# EAGLE design MicroMod_Sno_Processor (EAGLE 9.5.2)
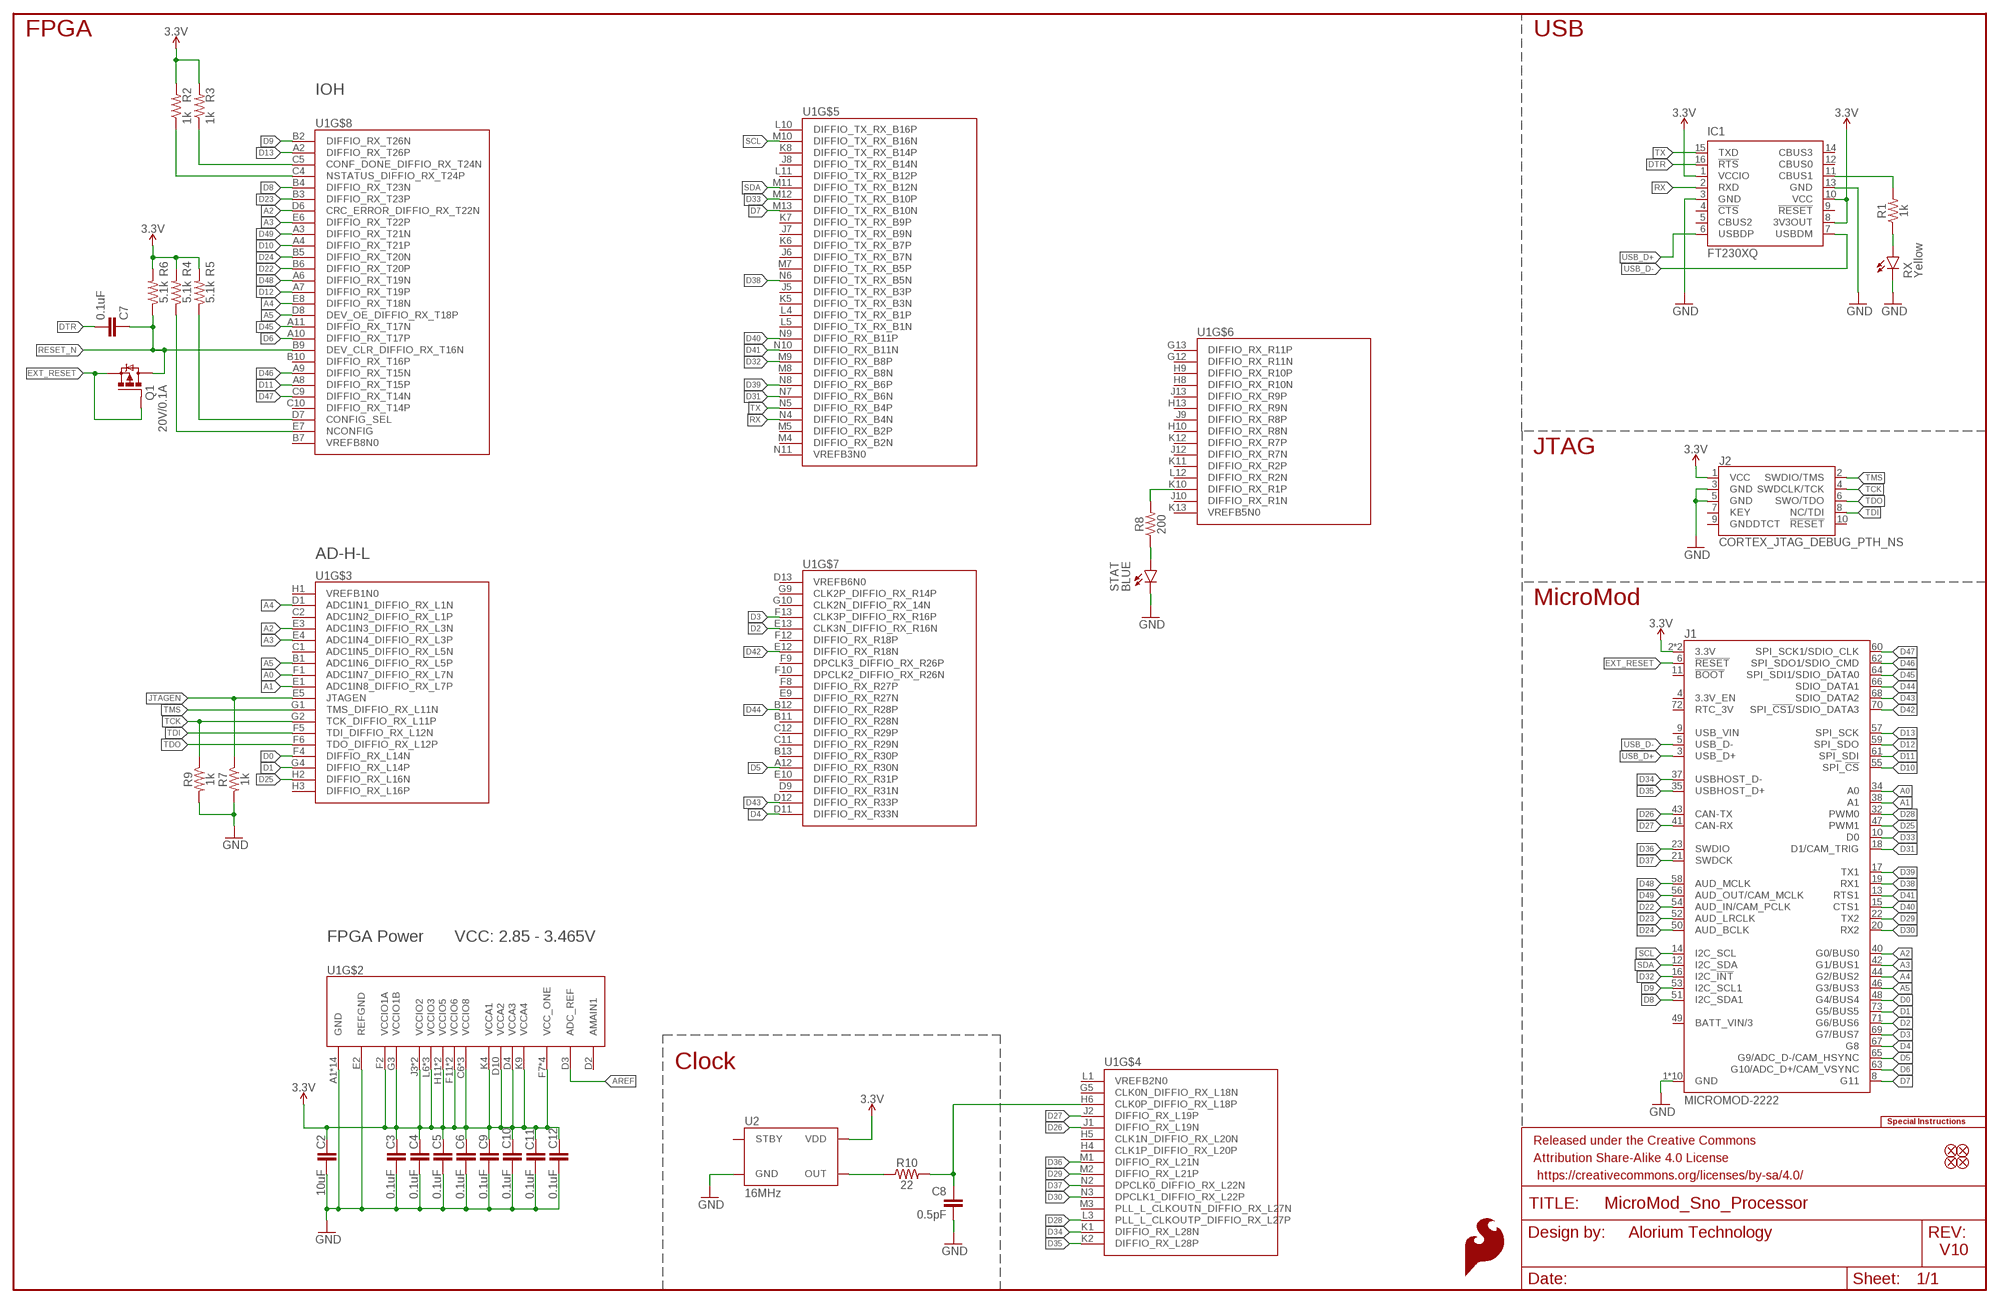
[diagram p0: schematic, sheet 1]

## Parts
C2  10uF  10UF-0402T-6.3V-20%  [0402-TIGHT]
C3  0.1uF  0.1UF-0402T-6.3V-10%-X7R  [0402-TIGHT]
C4  0.1uF  0.1UF-0402T-6.3V-10%-X7R  [0402-TIGHT]
C5  0.1uF  0.1UF-0402T-6.3V-10%-X7R  [0402-TIGHT]
C6  0.1uF  0.1UF-0402T-6.3V-10%-X7R  [0402-TIGHT]
C7  0.1uF  0.1UF-0402T-6.3V-10%-X7R  [0402-TIGHT]
C8  0.5pF  0.5PF-0402_TIGHT-50V-PM0.05PF-NP0  [0402-TIGHT]
C9  0.1uF  0.1UF-0402T-6.3V-10%-X7R  [0402-TIGHT]
C10  0.1uF  0.1UF-0402T-6.3V-10%-X7R  [0402-TIGHT]
C11  0.1uF  0.1UF-0402T-6.3V-10%-X7R  [0402-TIGHT]
C12  0.1uF  0.1UF-0402T-6.3V-10%-X7R  [0402-TIGHT]
FID1  FIDUCIAL1X2  [FIDUCIAL-1X2]
FID2  FIDUCIAL1X2  [FIDUCIAL-1X2]
FID3  FIDUCIAL1X2  [FIDUCIAL-1X2]
FID4  FIDUCIAL1X2  [FIDUCIAL-1X2]
FRAME1  FRAME-LEDGER  [CREATIVE_COMMONS]
IC1  FT230XQ  [QFN16]
J1  MICROMOD-2222  [M.2-CARD-E-22]
J2  CORTEX_JTAG_DEBUG_PTH_NS  [2X5-PTH-1.27MM-NO_SILK]
LOGO1  SPECIAL_INSTRUCTIONS-ORDERING  [ORDERING_INSTRUCTIONS]
LOGO2  SFE_LOGO_FLAME.1_INCH  [SFE_LOGO_FLAME_.1]
Q1  20V/0.1A  RE1C001ZP  [SOT-416]
R1  1k  1KOHM-0402T-1/16W-1%  [0402-TIGHT]
R2  1k  1KOHM-0402T-1/16W-1%  [0402-TIGHT]
R3  1k  1KOHM-0402T-1/16W-1%  [0402-TIGHT]
R4  5.1k  5.1KOHM-0402T-1/16W-1%  [0402-TIGHT]
R5  5.1k  5.1KOHM-0402T-1/16W-1%  [0402-TIGHT]
R6  5.1k  5.1KOHM-0402T-1/16W-1%  [0402-TIGHT]
R7  1k  1KOHM-0402T-1/16W-1%  [0402-TIGHT]
R8  200  200OHM-0402T-1/16W-1%  [0402-TIGHT]
R9  1k  1KOHM-0402T-1/16W-1%  [0402-TIGHT]
R10  22  22OHM-0402T-1/16W-1%  [0402-TIGHT]
RX  Yellow  LED-YELLOW0603  [LED-0603]
STAT  BLUE  LED-BLUE0603  [LED-0603]
U1  10M08SA  [UBGA_169]
U2  16MHz  OSC_TINY_16SMD20X16  [SMD20X16]

## Nets
3.3V: C2.1 C3.1 C4.1 C5.1 C6.1 C9.1 C10.1 C11.1 C12.1 IC1.1(VCCIO) IC1.8(3V3OUT) IC1.10(VCC) J1.2(3.3V) J1.74(3.3V) J2.1(VCC) R2.2 R3.2 R4.2 R5.2 R6.2 U1.C6(VCCIO8) U1.C7(VCCIO8) U1.C8(VCCIO8) U1.D4(VCCA3) U1.D10(VCCA2) U1.F2(VCCIO1A) U1.F7(VCC_ONE) U1.F11(VCCIO6) U1.G3(VCCIO1B) U1.G6(VCC_ONE) U1.G8(VCC_ONE) U1.G11(VCCIO6) U1.H7(VCC_ONE) U1.H11(VCCIO5) U1.J3(VCCIO2) U1.J11(VCCIO5) U1.K3(VCCIO2) U1.K4(VCCA1) U1.K9(VCCA4) U1.L6(VCCIO3) U1.L7(VCCIO3) U1.L8(VCCIO3) U2.4(VDD)
A0: J1.34(A0) U1.F1(ADC1IN7_DIFFIO_RX_L7N)
A1: J1.38(A1) U1.E1(ADC1IN8_DIFFIO_RX_L7P)
A2: J1.40(G0/BUS0) U1.D6(CRC_ERROR_DIFFIO_RX_T22N) U1.E3(ADC1IN3_DIFFIO_RX_L3N)
A3: J1.42(G1/BUS1) U1.E4(ADC1IN4_DIFFIO_RX_L3P) U1.E6(DIFFIO_RX_T22P)
A4: J1.44(G2/BUS2) U1.D1(ADC1IN1_DIFFIO_RX_L1N) U1.E8(DIFFIO_RX_T18N)
A5: J1.46(G3/BUS3) U1.B1(ADC1IN6_DIFFIO_RX_L5P) U1.D8(DEV_OE_DIFFIO_RX_T18P)
AREF: U1.D3(ADC_REF)
CLK: C8.1 R10.2 U1.H6(CLK0P_DIFFIO_RX_L18P)
D0: J1.48(G4/BUS4) U1.F4(DIFFIO_RX_L14N)
D1: J1.73(G5/BUS5) U1.G4(DIFFIO_RX_L14P)
D2: J1.71(G6/BUS6) U1.E13(CLK3N_DIFFIO_RX_R16N)
D3: J1.69(G7/BUS7) U1.F13(CLK3P_DIFFIO_RX_R16P)
D4: J1.67(G8) U1.D11(DIFFIO_RX_R33N)
D5: J1.65(G9/ADC_D-/CAM_HSYNC) U1.A12(DIFFIO_RX_R30N)
D6: J1.63(G10/ADC_D+/CAM_VSYNC) U1.A10(DIFFIO_RX_T17P)
D7: J1.8(G11) U1.M13(DIFFIO_TX_RX_B10N)
D8: J1.51(I2C_SDA1) U1.B4(DIFFIO_RX_T23N)
D9: J1.53(I2C_SCL1) U1.B2(DIFFIO_RX_T26N)
D10: J1.55(SPI_!CS!) U1.A4(DIFFIO_RX_T21P)
D11: J1.61(SPI_SDI) U1.A8(DIFFIO_RX_T15P)
D12: J1.59(SPI_SDO) U1.A7(DIFFIO_RX_T19P)
D13: J1.57(SPI_SCK) U1.A2(DIFFIO_RX_T26P)
D22: J1.54(AUD_IN/CAM_PCLK) U1.B6(DIFFIO_RX_T20P)
D23: J1.52(AUD_LRCLK) U1.B3(DIFFIO_RX_T23P)
D24: J1.50(AUD_BCLK) U1.B5(DIFFIO_RX_T20N)
D25: J1.47(PWM1) U1.H2(DIFFIO_RX_L16N)
D26: J1.43(CAN-TX) U1.J1(DIFFIO_RX_L19N)
D27: J1.41(CAN-RX) U1.J2(DIFFIO_RX_L19P)
D28: J1.32(PWM0) U1.L3(PLL_L_CLKOUTP_DIFFIO_RX_L27P)
D29: J1.22(TX2) U1.M2(DIFFIO_RX_L21P)
D30: J1.20(RX2) U1.N3(DPCLK1_DIFFIO_RX_L22P)
D31: J1.18(D1/CAM_TRIG) U1.N7(DIFFIO_RX_B6N)
D32: J1.16(I2C_!INT!) U1.M9(DIFFIO_RX_B8P)
D33: J1.10(D0) U1.M12(DIFFIO_TX_RX_B10P)
D34: J1.37(USBHOST_D-) U1.K1(DIFFIO_RX_L28N)
D35: J1.35(USBHOST_D+) U1.K2(DIFFIO_RX_L28P)
D36: J1.23(SWDIO) U1.M1(DIFFIO_RX_L21N)
D37: J1.21(SWDCK) U1.N2(DPCLK0_DIFFIO_RX_L22N)
D38: J1.19(RX1) U1.N6(DIFFIO_TX_RX_B5N)
D39: J1.17(TX1) U1.N8(DIFFIO_RX_B6P)
D40: J1.15(CTS1) U1.N9(DIFFIO_RX_B11P)
D41: J1.13(RTS1) U1.N10(DIFFIO_RX_B11N)
D42: J1.70(SPI_!CS1!/SDIO_DATA3) U1.E12(DIFFIO_RX_R18N)
D43: J1.68(SDIO_DATA2) U1.D12(DIFFIO_RX_R33P)
D44: J1.66(SDIO_DATA1) U1.B12(DIFFIO_RX_R28P)
D45: J1.64(SPI_SDI1/SDIO_DATA0) U1.A11(DIFFIO_RX_T17N)
D46: J1.62(SPI_SDO1/SDIO_CMD) U1.A9(DIFFIO_RX_T15N)
D47: J1.60(SPI_SCK1/SDIO_CLK) U1.C9(DIFFIO_RX_T14N)
D48: J1.58(AUD_MCLK) U1.A6(DIFFIO_RX_T19N)
D49: J1.56(AUD_OUT/CAM_MCLK) U1.A3(DIFFIO_RX_T21N)
DTR: C7.2 IC1.16(!RTS)
EXT_RESET: J1.6(!RESET!) Q1.P1(G) Q1.P2(S)
GND: C2.2 C3.2 C4.2 C5.2 C6.2 C8.2 C9.2 C10.2 C11.2 C12.2 IC1.3(GND) IC1.13(GND) J1.1(GND) J1.7(GND) J1.33(GND) J1.36(GND) J1.39(GND) J1.45(GND) J1.75(GND) J1.GND1(GND) J1.GND2(GND) J1.GND3(GND) J2.3(GND) J2.5(GND) R7.2 R9.2 RX.C STAT.C U1.A1(GND) U1.A13(GND) U1.B8(GND) U1.C3(GND) U1.D5(GND) U1.E2(REFGND) U1.E11(GND) U1.F3(GND) U1.G7(GND) U1.H12(GND) U1.J4(GND) U1.L9(GND) U1.M6(GND) U1.N1(GND) U1.N13(GND) U2.2(GND)
JTAGEN: R7.1 U1.E5(JTAGEN)
N$2: R1.1 RX.A
N$18: R3.1 U1.C5(CONF_DONE_DIFFIO_RX_T24N)
N$36: R8.1 STAT.A
N$59: R2.1 U1.C4(NSTATUS_DIFFIO_RX_T24P)
N$67: R5.1 U1.D7(CONFIG_SEL)
NCONFIG: R4.1 U1.E7(NCONFIG)
OSC: R10.1 U2.3(OUT)
RESET_N: C7.1 Q1.P3(D) R6.1 U1.B9(DEV_CLR_DIFFIO_RX_T16N)
RX: IC1.2(RXD) U1.N4(DIFFIO_RX_B4N)
RXLED: IC1.11(CBUS1) R1.2
SCL: J1.14(I2C_SCL) U1.M10(DIFFIO_TX_RX_B16N)
SDA: J1.12(I2C_SDA) U1.M11(DIFFIO_TX_RX_B12N)
STAT: R8.2 U1.K10(DIFFIO_RX_R1P)
TCK: J2.4(SWDCLK/TCK) R9.1 U1.G2(TCK_DIFFIO_RX_L11P)
TDI: J2.8(NC/TDI) U1.F5(TDI_DIFFIO_RX_L12N)
TDO: J2.6(SWO/TDO) U1.F6(TDO_DIFFIO_RX_L12P)
TMS: J2.2(SWDIO/TMS) U1.G1(TMS_DIFFIO_RX_L11N)
TX: IC1.15(TXD) U1.N5(DIFFIO_RX_B4P)
USB_D+: IC1.6(USBDP) J1.3(USB_D+)
USB_D-: IC1.7(USBDM) J1.5(USB_D-)
Unconnected: IC1.4(!CTS) IC1.5(CBUS2) IC1.9(!RESET) IC1.12(CBUS0) IC1.14(CBUS3) J1.4(3.3V_EN) J1.9(USB_VIN) J1.11(!BOOT!) J1.49(BATT_VIN/3) J1.72(RTC_3V) J2.7(KEY) J2.9(GNDDTCT) J2.10(!RESET) U1.B7(VREFB8N0) U1.B10(DIFFIO_RX_T16P) U1.B11(DIFFIO_RX_R28N) U1.B13(DIFFIO_RX_R30P) U1.C1(ADC1IN5_DIFFIO_RX_L5N) U1.C2(ADC1IN2_DIFFIO_RX_L1P) U1.C10(DIFFIO_RX_T14P) U1.C11(DIFFIO_RX_R29N) U1.C12(DIFFIO_RX_R29P) U1.D2(AMAIN1) U1.D9(DIFFIO_RX_R31N) U1.D13(VREFB6N0) U1.E9(DIFFIO_RX_R27N) U1.E10(DIFFIO_RX_R31P) U1.F8(DIFFIO_RX_R27P) U1.F9(DPCLK3_DIFFIO_RX_R26P) U1.F10(DPCLK2_DIFFIO_RX_R26N) U1.F12(DIFFIO_RX_R18P) U1.G5(CLK0N_DIFFIO_RX_L18N) U1.G9(CLK2P_DIFFIO_RX_R14P) U1.G10(CLK2N_DIFFIO_RX_14N) U1.G12(DIFFIO_RX_R11N) U1.G13(DIFFIO_RX_R11P) U1.H1(VREFB1N0) U1.H3(DIFFIO_RX_L16P) U1.H4(CLK1P_DIFFIO_RX_L20P) U1.H5(CLK1N_DIFFIO_RX_L20N) U1.H8(DIFFIO_RX_R10N) U1.H9(DIFFIO_RX_R10P) U1.H10(DIFFIO_RX_R8N) U1.H13(DIFFIO_RX_R9N) U1.J5(DIFFIO_TX_RX_B3P) U1.J6(DIFFIO_TX_RX_B7N) U1.J7(DIFFIO_TX_RX_B9N) U1.J8(DIFFIO_TX_RX_B14N) U1.J9(DIFFIO_RX_R8P) U1.J10(DIFFIO_RX_R1N) U1.J12(DIFFIO_RX_R7N) U1.J13(DIFFIO_RX_R9P) U1.K5(DIFFIO_TX_RX_B3N) U1.K6(DIFFIO_TX_RX_B7P) U1.K7(DIFFIO_TX_RX_B9P) U1.K8(DIFFIO_TX_RX_B14P) U1.K11(DIFFIO_RX_R2P) U1.K12(DIFFIO_RX_R7P) U1.K13(VREFB5N0) U1.L1(VREFB2N0) U1.L4(DIFFIO_TX_RX_B1P) U1.L5(DIFFIO_TX_RX_B1N) U1.L10(DIFFIO_TX_RX_B16P) U1.L11(DIFFIO_TX_RX_B12P) U1.L12(DIFFIO_RX_R2N) U1.M3(PLL_L_CLKOUTN_DIFFIO_RX_L27N) U1.M4(DIFFIO_RX_B2N) U1.M5(DIFFIO_RX_B2P) U1.M7(DIFFIO_TX_RX_B5P) U1.M8(DIFFIO_RX_B8N) U1.N11(VREFB3N0) U2.1(STBY)

## Notes on the sheet
- FPGA | USB
- IOH
- JTAG
- AD-H-L
- MicroMod
- FPGA Power | VCC: 2.85 - 3.465V
- Clock
- Alorium Technology
- V10

## Library data of the parts
C2 = SparkFun-Capacitors:10UF: 10.0µF ceramic capacitors A capacitor is a passive two-terminal electrical component used to store electrical energy temporarily in an electric field.; PROD_ID: CAP-14848
C3-C7 C9-C12 = SparkFun-Capacitors:0.1UF: 0.1µF ceramic capacitors A capacitor is a passive two-terminal electrical component used to store electrical energy temporarily in an electric field.; PROD_ID: CAP-14993
C8 = SparkFun-Capacitors:0.5PF: 0.5pF ceramic capacitors A capacitor is a passive two-terminal electrical component used to store electrical energy temporarily in an electric field.; PROD_ID: CAP-14362
FID1-FID4 = SparkFun-Aesthetics:FIDUCIAL: Fiducial Alignment Points Point-of-reference for pick-and-place machines and other optical instruments.
FRAME1 = SparkFun-Aesthetics:FRAME-LEDGER: Schematic Frame - Ledger Standard 11x14 US Ledger frame
IC1 = New_Parts:FT230X: USB to BASIC UART IC Auto generated by make-symbol-device-package-bsdl.ulp Rev. 43 Source: Data sheet <http://www.ftdichip.com/Support/Documents/DataSheets/ICs/DS_FT230X.pdf>; DIGIKEY_PART: 768-1130-2-ND; PROD_ID: IC-15930
J1 = SparkFun-MicroMod:MICROMOD: MicroMod Connector Description: A card edge connector and mating PCB connector to allow various MicroMod Processor Boards to be coupled with various carrier boards of different capabilities. Based on the M.2 standard.
J2 = SparkFun-Connectors:CORTEX_JTAG_DEBUG: Cortex Debug Connector - 10 pin Supports JTAG debug, Serial Wire debug, and Serial Wire Viewer. PTH and SMD connector options available. General Connector Information <http://infocenter.arm.com/help/topic/com.arm.doc.faqs/attached/13634/cortex_debug_connectors.pdf> Products: PTH Connector <http://www.digikey.com/product-detail/en/cnc-tech/3220-10-0100-00/1175-1627-ND/3883661> -via Digi-Key SparkFun PSoc <https://www.sparkfun.com/products/13229> SparkFun T <https://www.sparkfun.com/products/13810>
LOGO1 = SparkFun-Aesthetics:SPECIAL_INSTRUCTIONS: Special Ordering/Production Instructions Alert Symbol for special PCB ordering instructions or unique production process warnings. Ordering Instructions Production Instructions Types of information that should be added to box: Copper weight Soldermask color Silk color PCB thickness Number of layers PCB Standard: 1.6mm FR4 1 oz copper immersion silver plating red soldermask white silkscreen Types of information that should be added to box: Special wash requirements Depaneling instructions Humidification Glue curing Default text settings: 0.07 inch 9% ratio 50% line distance
LOGO2 = SparkFun-Aesthetics:SFE_LOGO_FLAME: SparkFun Flame Logo This is the SparkFun flame logo. The logo on the schematic will always be the same size; the package variant is the height of the flame. Default layer for the logo on the board is tSilk.
Q1 = New_Parts:RE1C001ZP; PROD_ID: TRANS-15421
R1-R3 R7 R9 = SparkFun-Resistors:1KOHM: 1kΩ resistor A resistor is a passive two-terminal electrical component that implements electrical resistance as a circuit element. Resistors act to reduce current flow, and, at the same time, act to lower voltage levels within circuits. - Wikipedia; PROD_ID: RES-14342
R4-R6 = SparkFun-Resistors:5.1KOHM; PROD_ID: RES-14340
R8 = SparkFun-Resistors:200OHM: 200Ω resistor A resistor is a passive two-terminal electrical component that implements electrical resistance as a circuit element. Resistors act to reduce current flow, and, at the same time, act to lower voltage levels within circuits. - Wikipedia; PROD_ID: RES-15550
R10 = SparkFun-Resistors:22OHM: 22Ω resistor A resistor is a passive two-terminal electrical component that implements electrical resistance as a circuit element. Resistors act to reduce current flow, and, at the same time, act to lower voltage levels within circuits. - Wikipedia; PROD_ID: RES-12427; VALUE: 22Ω
RX = SparkFun-LED:LED-YELLOW: Yellow SMD LED Used in manufacturing several products at SparkFun. Packages: 0603 - SMD 0603 package[Product Link] <http://www.kingbrightusa.com/product.asp?catalog_name=LED&product_id=APT1608SYCK> 0603 -SMART - SMART SMD 0603 package (more efficient/more expensive) [Product Link] <http://www.osram-os.com/osram_os/en/products/product-catalog/led-light-emitting-diodes/smartled-0603/ly-l29k/index.jsp> LilyPad - SMD1206 package[Product Datasheet] <https://www.sparkfun.com/datasheets/DevTools/LilyPad/Q150YUS4.pdf> SparkFun Products: Blynk Board <https://www.sparkfun.com/products/13794> IOIO-OTG <https://www.sparkfun.com/products/13613> XBee Explorer Serial <https://www.sparkfun.com/products/13225>; PROD_ID: DIO-09003
STAT = SparkFun-LED:LED-BLUE: Blue SMD LED Used in manufacturing of various products at SparkFun Packages: 0603 - SMD 0603 package [Product Link] <http://www.digikey.com/product-detail/en/SMLE12BC7TT86/511-1589-2-ND/1641808> 1206 - SMD1206 package [Product Link] <http://www.digikey.com/product-detail/en/lite-on-inc/LTST-C150TBKT/160-1643-1-ND/573584> SparkFun Products: ESP8266 Thing-Dev Board <https://www.sparkfun.com/products/13711> RedBoard <https://www.sparkfun.com/products/12757>; PROD_ID: DIO-08575
U1 = New_Parts:10M08SA; DIGIKEY_PART: 544-3110-ND; PROD_ID: IC-15931
U2 = New_Parts:OSC_TINY_16; PROD_ID: XTAL-16018

## Board
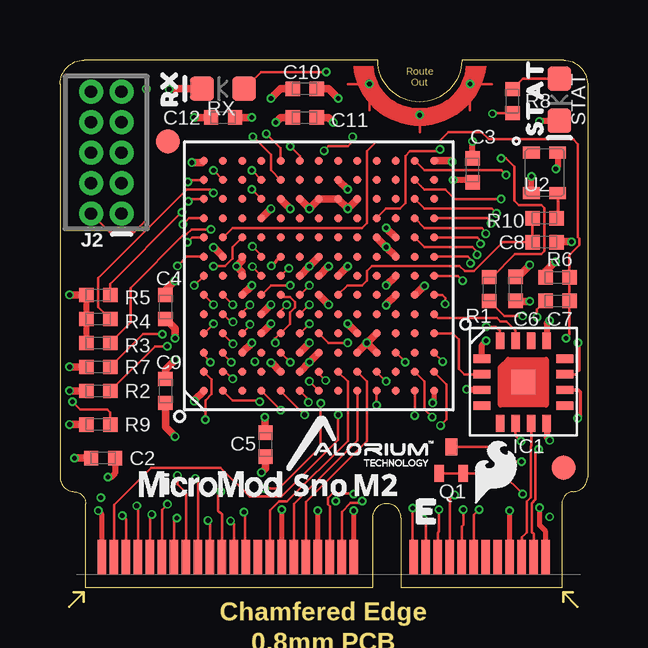
[diagram p1: board, top side]
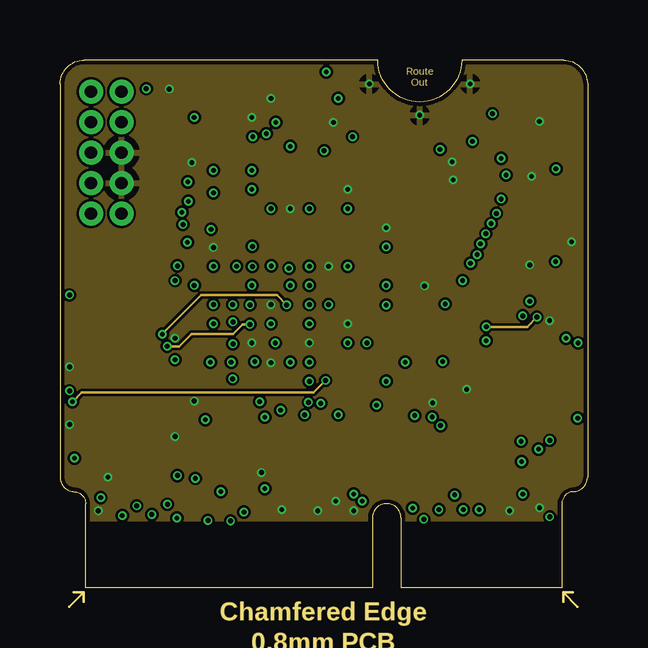
[diagram p2: board, inner layer Route2]
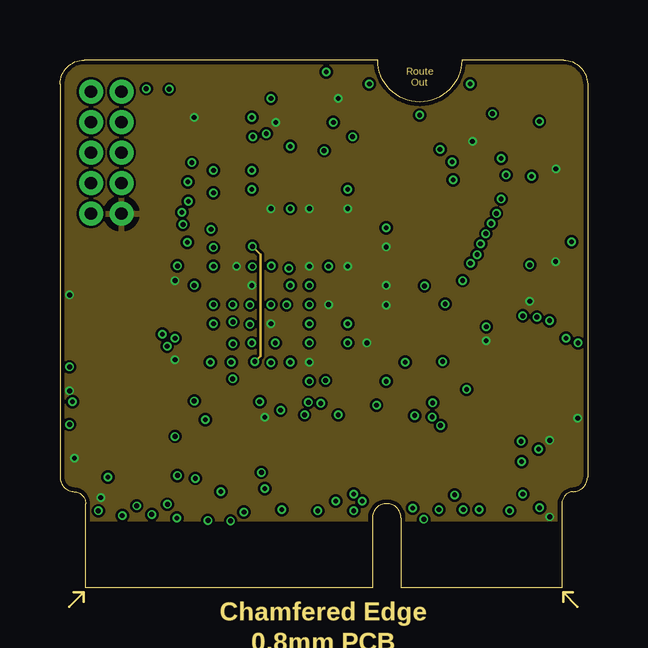
[diagram p3: board, inner layer Route15]
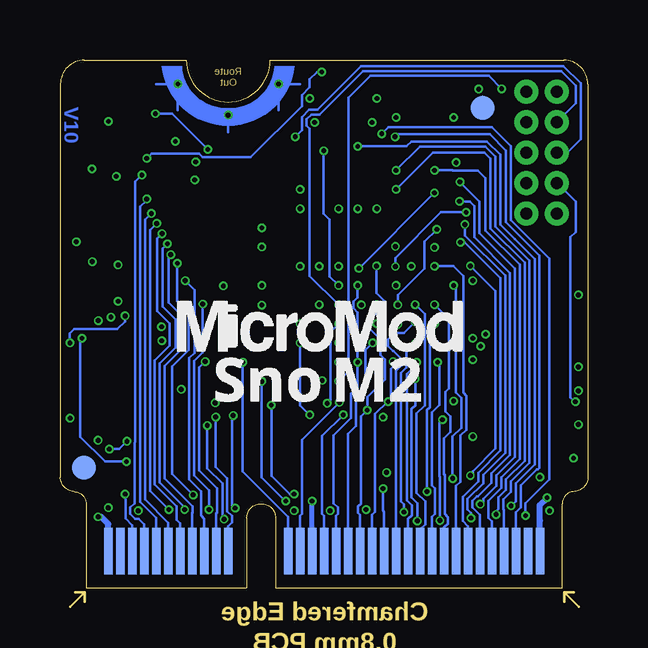
[diagram p4: board, bottom side, seen from below]

Size 22 x 22 mm. Coordinates in mm from the lower left corner, seen from the top.
Outline: 16.75,22 21,22 arc-87 22,21 22,4.6 arc-87 21.4,4 arc85 20.93,3.5 20.93,0 14.22,0 14.22,2.9 arc180 13.03,2.9 13.03,0 1.07,0 1.07,3.5 arc84 0.6,4 arc-87 0,4.6 0,21 arc-87 1,22 13.25,22
Outline: 16.75,22 arc-180 13.25,22
Outline: 16.75,22 arc-180 13.25,22
Copper layers (1+2*15+16): Top 0.035mm / dielectric 1.5mm / Route2 0.035mm / dielectric 0.15mm / Route15 0.035mm / dielectric 0.2mm / Bottom 0.035mm
Design rules "SparkFun-4-Layer-MicroMod-JLCPCB": minimum track width 4mil, minimum drill 0.2mm, track to track 4mil, track to pad 4mil, pad to pad 4mil, via to via 4mil, smd to smd 4mil, copper to edge 6mil, drill to drill 6mil, minimum pad ring 3mil, minimum via ring 3mil, stop-mask expansion 2.5mil, vias tented up to drill 25mil, thermal gap 10mil

### Footprints (pad centres in the part's own frame; a part is rotated, then mirrored left to right if it is on the bottom)
0402-TIGHT = smd 0.6 x 0.6: 1 -0.5,0; 2 0.5,0
FIDUCIAL-1X2 = smd 1 x 1: 1 0,0
QFN16 = smd 0.7 x 0.35: 1 -1.725,0.975; 2 -1.725,0.325; 3 -1.725,-0.325; 4 -1.725,-0.975; 9 1.725,-0.975; 10 1.725,-0.325; 11 1.725,0.325; 12 1.725,0.975 | smd 0.35 x 0.7: 5 -0.975,-1.725; 6 -0.325,-1.725; 7 0.325,-1.725; 8 0.975,-1.725; 13 0.975,1.725; 14 0.325,1.725; 15 -0.325,1.725; 16 -0.975,1.725 | smd 1 x 1: TAB 0,0
M.2-CARD-E-22 = smd 0.35 x 1.45: 1 9.25,1.275; 3 8.75,1.275; 5 8.25,1.275; 7 7.75,1.275; 9 7.25,1.275; 11 6.75,1.275; 13 6.25,1.275; 15 5.75,1.275; 17 5.25,1.275; 19 4.75,1.275; 21 4.25,1.275; 23 3.75,1.275; 33 1.25,1.275; 35 0.75,1.275; 37 0.25,1.275; 39 -0.25,1.275; 41 -0.75,1.275; 43 -1.25,1.275; 45 -1.75,1.275; 47 -2.25,1.275; 49 -2.75,1.275; 51 -3.25,1.275; 53 -3.75,1.275; 55 -4.25,1.275; 57 -4.75,1.275; 59 -5.25,1.275; 61 -5.75,1.275; 63 -6.25,1.275; 65 -6.75,1.275; 67 -7.25,1.275; 69 -7.75,1.275; 71 -8.25,1.275; 73 -8.75,1.275; 75 -9.25,1.275 | smd 0.35 x 1.95 bottom: 2 9,1.525; 4 8.5,1.525; 6 8,1.525; 8 7.5,1.525; 10 7,1.525; 12 6.5,1.525; 14 6,1.525; 16 5.5,1.525; 18 5,1.525; 20 4.5,1.525; 22 4,1.525; 32 1.5,1.525; 34 1,1.525; 36 0.5,1.525; 38 0,1.525; 40 -0.5,1.525; 42 -1,1.525; 44 -1.5,1.525; 46 -2,1.525; 48 -2.5,1.525; 50 -3,1.525; 52 -3.5,1.525; 54 -4,1.525; 56 -4.5,1.525; 58 -5,1.525; 60 -5.5,1.525; 62 -6,1.525; 64 -6.5,1.525; 66 -7,1.525; 68 -7.5,1.525; 70 -8,1.525; 72 -8.5,1.525; 74 -9,1.525 | drill 0.2: GND1 1.9,21; GND2 4,19.7; GND3 6.1,21
2X5-PTH-1.27MM-NO_SILK = drill 0.508 pad 1: 1 -2.54,-0.635; 2 -2.54,0.635; 3 -1.27,-0.635; 4 -1.27,0.635; 5 0,-0.635; 6 0,0.635; 7 1.27,-0.635; 8 1.27,0.635; 9 2.54,-0.635; 10 2.54,0.635
SOT-416 = smd 0.4 x 0.7: P1 -0.5,0; P2 0.5,0 | smd 0.5 x 0.7: P3 0,1.1
LED-0603 = smd 1 x 1: A -0.877,0; C 0.877,0
UBGA_169 = smd 0.34 x 0.34: A1 -9.6,0; A2 -8.8,0; A3 -8,0; A4 -7.2,0; A5 -6.4,0; A6 -5.6,0; A7 -4.8,0; A8 -4,0; A9 -3.2,0; A10 -2.4,0; A11 -1.6,0; A12 -0.8,0; A13 0,0; B1 -9.6,-0.8; B2 -8.8,-0.8; B3 -8,-0.8; B4 -7.2,-0.8; B5 -6.4,-0.8; B6 -5.6,-0.8; B7 -4.8,-0.8; B8 -4,-0.8; B9 -3.2,-0.8; B10 -2.4,-0.8; B11 -1.6,-0.8; B12 -0.8,-0.8; B13 0,-0.8; C1 -9.6,-1.6; C2 -8.8,-1.6; C3 -8,-1.6; C4 -7.2,-1.6; C5 -6.4,-1.6; C6 -5.6,-1.6; C7 -4.8,-1.6; C8 -4,-1.6; C9 -3.2,-1.6; C10 -2.4,-1.6; C11 -1.6,-1.6; C12 -0.8,-1.6; C13 0,-1.6; D1 -9.6,-2.4; D2 -8.8,-2.4; D3 -8,-2.4; D4 -7.2,-2.4; D5 -6.4,-2.4; D6 -5.6,-2.4; D7 -4.8,-2.4; D8 -4,-2.4; D9 -3.2,-2.4; D10 -2.4,-2.4; D11 -1.6,-2.4; D12 -0.8,-2.4; D13 0,-2.4; E1 -9.6,-3.2; E2 -8.8,-3.2; E3 -8,-3.2; E4 -7.2,-3.2; E5 -6.4,-3.2; E6 -5.6,-3.2; E7 -4.8,-3.2; E8 -4,-3.2; E9 -3.2,-3.2; E10 -2.4,-3.2; E11 -1.6,-3.2; E12 -0.8,-3.2; E13 0,-3.2; F1 -9.6,-4; F2 -8.8,-4; F3 -8,-4; F4 -7.2,-4; F5 -6.4,-4; F6 -5.6,-4; F7 -4.8,-4; F8 -4,-4; F9 -3.2,-4; F10 -2.4,-4; F11 -1.6,-4; F12 -0.8,-4; F13 0,-4; G1 -9.6,-4.8; G2 -8.8,-4.8; G3 -8,-4.8; G4 -7.2,-4.8; G5 -6.4,-4.8; G6 -5.6,-4.8; G7 -4.8,-4.8; G8 -4,-4.8; G9 -3.2,-4.8; G10 -2.4,-4.8; G11 -1.6,-4.8; G12 -0.8,-4.8; G13 0,-4.8; H1 -9.6,-5.6; H2 -8.8,-5.6; H3 -8,-5.6; H4 -7.2,-5.6; H5 -6.4,-5.6; H6 -5.6,-5.6; H7 -4.8,-5.6; H8 -4,-5.6; H9 -3.2,-5.6; H10 -2.4,-5.6; H11 -1.6,-5.6; H12 -0.8,-5.6; H13 0,-5.6; J1 -9.6,-6.4; J2 -8.8,-6.4; J3 -8,-6.4; J4 -7.2,-6.4; J5 -6.4,-6.4; J6 -5.6,-6.4; J7 -4.8,-6.4; J8 -4,-6.4; J9 -3.2,-6.4; J10 -2.4,-6.4; J11 -1.6,-6.4; J12 -0.8,-6.4; J13 0,-6.4; K1 -9.6,-7.2; K2 -8.8,-7.2; K3 -8,-7.2; K4 -7.2,-7.2; K5 -6.4,-7.2; K6 -5.6,-7.2; K7 -4.8,-7.2; K8 -4,-7.2; K9 -3.2,-7.2; K10 -2.4,-7.2; K11 -1.6,-7.2; K12 -0.8,-7.2; K13 0,-7.2; L1 -9.6,-8; L2 -8.8,-8; L3 -8,-8; L4 -7.2,-8; L5 -6.4,-8; L6 -5.6,-8; L7 -4.8,-8; L8 -4,-8; L9 -3.2,-8; L10 -2.4,-8; L11 -1.6,-8; L12 -0.8,-8; L13 0,-8; M1 -9.6,-8.8; M2 -8.8,-8.8; M3 -8,-8.8; M4 -7.2,-8.8; M5 -6.4,-8.8; M6 -5.6,-8.8; M7 -4.8,-8.8; M8 -4,-8.8; M9 -3.2,-8.8; M10 -2.4,-8.8; M11 -1.6,-8.8; M12 -0.8,-8.8; M13 0,-8.8; N1 -9.6,-9.6; N2 -8.8,-9.6; N3 -8,-9.6; N4 -7.2,-9.6; N5 -6.4,-9.6; N6 -5.6,-9.6; N7 -4.8,-9.6; N8 -4,-9.6; N9 -3.2,-9.6; N10 -2.4,-9.6; N11 -1.6,-9.6; N12 -0.8,-9.6; N13 0,-9.6
SMD20X16 = smd 0.5 x 0.7: 1 -0.85,-0.55; 2 0.85,-0.55; 3 0.85,0.55; 4 -0.85,0.55

### Placement (x,y rotation side)
C2  1.8,5.4 0 top
C3  17.2,17.4 270 top
C4  4.4,11.7 270 top
C5  8.57,5.96 270 top
C6  18.99,12.45 90 top
C7  20.74,11.95 180 top
C8  20.2,14.4 0 top
C9  4.4,8.2 270 top
C10  10.2,20.8 180 top
C11  10.2,19.6 0 top
C12  6.8,19.6 0 top
FID1  21,5 0 top
FID2  4.5,18.6 0 top
FID3  4.39,20.01 0 bottom
FID4  21.02,5 0 bottom
FRAME1  49.43,-1.68 0 top  (outside the outline)
IC1  19.32,8.57 0 top
J1  11,0 0 top
J2  1.93,18.14 90 top
LOGO1  32.36,59.66 0 top  (outside the outline)
LOGO2  18.16,4.83 0 top
Q1  16.32,4.76 0 top
R1  17.9,12.45 270 top
R2  1.6,8.2 180 top
R3  1.6,10.2 180 top
R4  1.6,11.2 180 top
R5  1.6,12.2 180 top
R6  20.74,12.93 180 top
R7  1.6,9.2 180 top
R8  18.87,20.28 270 top
R9  1.6,6.8 180 top
R10  20.2,15.4 180 top
RX  6.8,20.8 180 top
STAT  20.82,20.34 270 top
U1  6,17.8 90 top
U2  20.2,17.29 270 top
U$1  [STAT0]  19.81,20.45 90 top
U$2  [RX0]  4.57,20.83 90 top

### Tracks (layer width: path | path; a pad name or v marks a point on that pad's centre or on a via)
3.3V  (via drill 0.2)
  Top 0.152: IC1.10 21.61,8.24 21.69,8.16 21.69,7.16 v21.59,7.06
  Top 0.203: 13.6,11.8 v13.6,11.78
  Top 0.254: 4.4,12.4 C4.1 | C3.1 v17.2,18.6 | IC1.1 17.6,10.12 v17.77,10.29 | IC1.8 20.3,6.26 v20.42,6.14 | R3.2 R4.2 R5.2 | U2.4 20.75,17.53 v20.68,17.46
  Top 0.305: U1.F11 v10.4,15.8 U1.G11 U1.H11 v12,15.8 U1.J11 | v8.8,15.8 U1.D10 | v8.8,11 U1.D4 | U1.K3 v12.8,10.2 | v12.8,10.2 U1.J3 | U1.K4 v12.8,10.2 | U1.L6 13.6,11.8 | U1.L7 v13.6,12.6 | v12,13.4 U1.H7 | v11.2,11.8 U1.G6 | v8,12.6 U1.C6 | C6.1 19.01,11.94 v19.59,11.94 | 4.4,12.4 v4.8,12.8 | C12.1 v5.6,19.6 | v4.8,9.5 4.4,9.1 C9.1 | v11.6,20.4 11.2,20.8 C10.1 | C2.1 v0.6,5.4 | v9,19.4 9.2,19.6 C11.1 | v0.4,12.2 R5.2 | R2.2 v0.4,8.2 | U1.G3 v10.4,9.4 U1.F2 | U1.F7 v10.4,13.4 U1.G8 | C5.1 8.54,6.49 v8.54,7.1 | U1.K9 v13.6,14.2 U1.L8 | U1.C7 7.6,13.16 v7.37,13.4 7.6,13.63 U1.C8 | R6.2 20.24,13.17 v20.67,13.59
  Bottom 0.254: J1.2 20,2.65 20.3,2.95 v20.42,2.95 | J1.74 2,2.79 2.02,2.81 2.02,3.43 v1.7,3.75
  pour Route15: 0,22 22,22 22,2.8 0,2.8
A0  (via drill 0.2)
  Top 0.102: U1.F1 10.36,7.84 v10.36,7.72
  Bottom 0.102: J1.34 12,2.98 11.92,3.06 11.92,6.16 v10.36,7.72
A1  (via drill 0.2)
  Top 0.102: U1.E1 v10.2,7.2
  Bottom 0.102: J1.38 11,2.98 11.08,3.06 11.08,6.32 v10.2,7.2
A2  (via drill 0.2)
  Top 0.102: U1.E3 v9.6,9.4 | v9.6,12.6 8.8,12.6 U1.D6
  Bottom 0.102: J1.40 10.5,2.98 10.42,3.06 10.42,3.34 10.6,3.52 10.6,6.33 9.87,7.06 9.87,8.09 9.6,8.36 v9.6,9.4 9.6,11.47 9.78,11.65 9.78,11.92 9.6,12.1 v9.6,12.6
A3  (via drill 0.2)
  Top 0.102: v8.98,10.2 8.98,10.38 U1.E4 9.6,11 9.6,11.47 9.8,11.68 9.8,11.9 9.59,12.11 9.29,12.11 U1.E6
  Bottom 0.102: v8.98,10.2 9.27,9.91 9.27,8.35 9.67,7.95 9.67,6.73 10,6.4 J1.42
A4  (via drill 0.2)
  Top 0.102: U1.D1 v9.2,7.4
  Top 0.152: v8.81,13.41 U1.E8
  Bottom 0.102: J1.44 9.5,3.04 9.58,3.11 9.58,3.39 9.46,3.5 9.46,7.13 v9.2,7.4 9.2,7.95 8.47,8.68 8.47,9.51 8.65,9.69 8.65,10.34 9.13,10.82 9.13,11.14 8.79,11.47 8.66,11.47 8.47,11.66 8.47,11.94 8.81,12.28 v8.81,13.41
A5  (via drill 0.2)
  Top 0.102: U1.B1 7.2,7.8 8.3,7.8 8.33,7.77 v8.33,7.75 | v8.03,14.22 8.4,13.85 U1.D8
  Route15 0.102: v8.13,9.42 v8.13,9.43 8.36,9.66 8.36,13.89 v8.03,14.22
  Bottom 0.102: J1.46 9,3.04 8.87,3.16 8.87,7.24 8.35,7.76 8.34,7.76 v8.33,7.75 8.2,7.88 8.2,9.12 8.13,9.2 v8.13,9.42
CLK
  Top 0.102: U1.H6 11.99,12.6 12.6,12.6 12.8,12.8 12.8,13.21 13.01,13.41 16.66,13.41 16.88,13.19 17.26,13.19 18.47,14.4 C8.1 R10.2
D0  (via drill 0.2)
  Top 0.102: U1.F4 v10.4,11 | v10.87,7.68 10.87,5.86 9.14,4.13 v8.54,4.13
  Bottom 0.102: v10.4,11 10.74,10.66 10.74,7.81 v10.87,7.68 | v8.54,4.13 8.54,3.21 8.5,3.17 J1.48
D1  (via drill 0.2)
  Top 0.102: U1.G4 11.2,10.2 v12,10.2 | J1.73 2.25,3.45 3.8,5 6.7,5 7.9,3.8 9.05,3.8 9.24,3.8 11.6,6.16 v11.6,7.2
  Bottom 0.102: v11.6,7.2 12,7.6 v12,10.2
D2  (via drill 0.2)
  Top 0.102: J1.71 2.75,2.85 v2.6,3 | v8.6,18.93 9.2,18.32 U1.E13
  Bottom 0.102: v8.6,18.93 8.32,19.2 4,19.2 3.21,18.41 3.21,15.33 1.62,13.73 1.62,4.5 2.6,3.52 v2.6,3
D3  (via drill 0.2)
  Top 0.102: J1.69 3.25,3.36 v3.2,3.41 | v9.6,18.4 10,18 U1.F13
  Bottom 0.102: v9.6,18.4 7.57,18.4 7.37,18.6 4.21,18.6 3.66,18.05 3.66,15.14 3.05,14.53 2.22,13.7 2.22,5.13 3.01,4.35 3.01,3.6 v3.2,3.41
D4  (via drill 0.2)
  Top 0.102: U1.D11 v8,16.6 | v3.83,3.05 3.75,2.97 J1.67
  Bottom 0.102: v3.83,3.05 3.83,3.18 3.73,3.28 3.73,3.75 3.41,4.07 3.41,4.51 2.64,5.29 2.64,13.54 4.06,14.97 4.06,17.88 4.32,18.14 6.46,18.14 v8,16.6
D5  (via drill 0.2)
  Top 0.102: J1.65 4.25,3.24 v4.49,3.47 | v5.33,16.92 5.42,17 U1.A12
  Bottom 0.102: v4.49,3.47 4.36,3.6 4.36,3.7 3.82,4.24 3.82,4.68 3.04,5.46 3.04,13.31 4.52,14.79 4.52,16.1 v5.33,16.92
D6  (via drill 0.2)
  Top 0.102: v4.88,2.9 v4.87,2.9 4.75,2.77 J1.63 | v5.13,15.14 5.39,15.4 U1.A10
  Bottom 0.102: v5.13,15.14 5.13,14.68 3.45,13 3.45,5.62 4.37,4.71 4.37,4.34 5.02,3.69 5.02,3.25 4.88,3.11 v4.88,2.9
D7  (via drill 0.2)
  Top 0.102: v18.6,17.2 18.4,17.4 15.2,17.4 U1.M13
  Bottom 0.102: v18.6,17.2 18.87,16.93 18.87,6.06 18.9,6.04 18.9,3.52 19.08,3.34 19.08,3.06 18.89,2.87 18.73,2.87 18.5,2.65 J1.8
D8  (via drill 0.2)
  Top 0.102: J1.51 7.72,1.3 7.72,3.1 v7.67,3.15 | v7.21,10.16 6.8,10.57 U1.B4
  Bottom 0.102: v7.21,10.16 7.57,9.8 7.57,9.18 7.8,8.95 7.8,3.6 7.67,3.47 v7.67,3.15
D9  (via drill 0.2)
  Top 0.102: J1.53 7.25,2.64 v7.11,2.78 | U1.B2 6.9,9 v7.2,8.7
  Bottom 0.102: v7.2,8.7 7.2,7.6 7.35,7.45 7.35,3.75 7.11,3.51 v7.11,2.78
D10  (via drill 0.2)
  Top 0.102: v6.4,11 U1.A4 | J1.55 6.75,3.05 6.6,3.2 6.6,3.89 v6.71,4
  Bottom 0.102: v6.4,11 6.6,10.8 6.6,7.51 6.71,7.4 v6.71,4
D11  (via drill 0.2)
  Top 0.102: v4.9,13.41 5.29,13.8 U1.A8 | J1.61 5.25,3.95 4.9,4.3 v4.9,4.67
  Bottom 0.102: v4.9,4.67 4.8,4.77 4.8,4.85 3.86,5.79 3.86,12.37 v4.9,13.41
D12  (via drill 0.2)
  Top 0.102: J1.59 5.75,4.55 v5.64,4.55 | v5.6,12.6 U1.A7
  Bottom 0.102: v5.64,4.55 5.64,6.29 5.27,6.67 5.27,7.91 5.5,8.14 5.5,12.5 v5.6,12.6
D13  (via drill 0.2)
  Top 0.102: J1.57 6.25,2.72 6.2,2.78 v6.17,2.8 | v6.07,7 6.07,7.81 6.32,8.07 6.32,8.68 U1.A2
  Bottom 0.102: v6.17,2.8 v6.18,2.8 6.18,4.62 6.2,4.64 6.2,6.31 6.19,6.32 6.19,6.88 v6.07,7
D22  (via drill 0.2)
  Top 0.102: v7.2,11.8 U1.B6
  Bottom 0.102: J1.54 7,2.43 6.79,2.64 6.79,3.58 7.15,3.95 7.15,7.25 6.8,7.6 6.8,8.2 6.8,11.4 v7.2,11.8
D23  (via drill 0.2)
  Top 0.102: v7.14,9.4 6.8,9.74 U1.B3
  Bottom 0.102: J1.52 7.5,2.86 7.34,3.01 7.34,3.43 7.56,3.64 7.56,7.64 7.55,7.65 7.55,8.91 7.26,9.2 7.26,9.28 v7.14,9.4
D24  (via drill 0.2)
  Top 0.102: v7.21,11.07 7.13,11.07 U1.B5
  Bottom 0.102: v7.21,11.07 7.67,10.62 8.05,10.62 8.33,10.34 8.33,10.06 8.14,9.87 8.11,9.87 7.77,9.54 7.77,9.26 8,9.04 J1.50
D25
  Top 0.102: U1.H2 12,8.6 12,6.12 9.48,3.6 9.13,3.6 8.75,3.21 J1.47
D26
  Top 0.102: U1.J1 12.4,6.13 9.75,3.48 J1.43
D27
  Top 0.102: U1.J2 12.8,8.6 12.8,6.12 10.25,3.57 J1.41
D28  (via drill 0.2)
  Top 0.102: U1.L3 v14.4,9.4
  Bottom 0.102: J1.32 12.5,2.95 14.4,4.85 v14.4,9.4
D29  (via drill 0.2)
  Top 0.102: U1.M2 15.2,8.6 15.2,7.43 v15.52,7.11
  Bottom 0.102: J1.22 15,2.55 14.84,2.71 14.84,2.98 15.04,3.17 15.04,4.55 15.52,5.04 v15.52,7.11
D30  (via drill 0.2)
  Top 0.102: v15.96,9.43 15.6,9.79 U1.N3
  Bottom 0.102: J1.20 15.5,3.09 15.47,3.12 15.47,4.14 16.22,4.89 16.22,9.17 v15.96,9.43
D31  (via drill 0.2)
  Top 0.102: U1.N7 16.6,13 v16.8,12.8 v16.79,12.8
  Bottom 0.102: v16.79,12.8 16.41,12.41 16.41,9.79 16.62,9.57 16.62,4.51 16.13,4.01 16.13,3 16,2.87 J1.18
D32  (via drill 0.2)
  Top 0.102: U1.M9 15.2,14.2 17.2,14.2 17.4,14 v17.4,13.88
  Bottom 0.102: v17.4,13.88 17.48,13.81 17.48,11.89 16.93,11.35 16.93,9.96 17.65,9.24 17.65,4.55 16.49,3.39 16.49,3.12 16.5,3.1 J1.16
D33  (via drill 0.2)
  Top 0.102: U1.M12 15.2,16.6 16.08,16.6 16.48,16.2 v18.4,16.2
  Bottom 0.102: v18.4,16.2 18.4,16.14 18.67,15.88 18.67,3.58 18,2.92 J1.10
D34  (via drill 0.2)
  Top 0.102: U1.K1 v13.2,7.6 | v12.25,3.89 12.21,3.93 11.36,3.93 11.17,3.74 11.17,3.46 11.25,3.38 J1.37
  Bottom 0.102: v13.2,7.6 13.2,4.67 12.43,3.89 v12.25,3.89
D35  (via drill 0.2)
  Top 0.102: U1.K2 v13.6,8.6 | v12.6,3.6 12.53,3.53 12.11,3.53 11.75,3.17 J1.35
  Bottom 0.102: v13.6,8.6 13.6,4.6 v12.6,3.6
D36  (via drill 0.2)
  Top 0.102: v14.71,3.31 14.71,1.32 J1.23 | U1.M1 v14.8,7.18 v14.79,7.17
  Bottom 0.102: v14.71,3.31 14.83,3.44 14.83,7.13 v14.79,7.17
D37  (via drill 0.2)
  Top 0.102: v15.17,2.85 15.25,2.77 J1.21 | v15.87,6.75 16.12,7.01 16.12,8.47 U1.N2
  Bottom 0.102: v15.17,2.85 15.24,2.85 15.24,4.34 15.87,4.97 v15.87,6.75
D38  (via drill 0.2)
  Top 0.102: v16.07,11.82 16.07,12.08 15.94,12.2 U1.N6 | v15.8,3.25 15.8,2.34 15.75,2.29 J1.19
  Bottom 0.102: v16.07,11.82 16.07,9.79 16.42,9.44 16.42,4.68 15.8,4.06 v15.8,3.25
D39  (via drill 0.2)
  Top 0.102: U1.N8 17,13.8 17.2,13.6 v17.12,13.52 | v16.46,3.86 16.44,3.86 16.25,3.67 J1.17
  Bottom 0.102: v17.12,13.52 17.12,11.95 16.66,11.49 16.66,9.9 17.34,9.21 17.34,4.74 v16.46,3.86
D40  (via drill 0.2)
  Top 0.102: U1.N9 17.4,14.6 17.6,14.4 v17.54,14.34 | v16.82,3.25 16.82,2.61 16.75,2.54 J1.15
  Bottom 0.102: v17.54,14.34 17.74,14.13 17.74,11.72 17.19,11.17 17.19,10.01 17.86,9.35 17.86,4.38 16.82,3.35 v16.82,3.25
D41  (via drill 0.2)
  Top 0.102: U1.N10 17.8,15.4 18,15.2 v17.98,15.18 | v17.48,3.25 17.47,3.25 17.25,3.03 J1.13
  Bottom 0.102: v17.98,15.18 18.26,14.9 18.26,4.04 v17.48,3.25
D42  (via drill 0.2)
  Top 0.102: U1.E12 8.8,17.4 8.8,18.04 v8.04,18.8
  Bottom 0.102: v8.04,18.8 7.94,18.9 4.09,18.9 3.42,18.23 3.42,15.24 2.02,13.84 2.02,4.99 2.08,4.93 2.14,4.93 2.8,4.26 2.8,3.34 3,3.14 J1.70
D43  (via drill 0.2)
  Top 0.102: U1.D12 v8,17.4
  Bottom 0.102: v8,17.4 7.01,18.39 4.28,18.39 3.86,17.97 3.86,15.05 2.44,13.63 2.44,5.2 3.21,4.43 3.21,3.99 3.53,3.67 3.53,3.27 3.5,3.24 J1.68
D44  (via drill 0.2)
  Top 0.102: U1.B12 v6.4,17.4
  Bottom 0.102: v6.4,17.4 5.64,17.4 5.63,17.39 4.59,17.39 4.27,17.07 4.27,14.89 2.84,13.46 2.84,5.37 3.62,4.6 3.62,4.16 4.16,3.62 4.16,2.91 4,2.75 J1.66
D45  (via drill 0.2)
  Top 0.102: v5.36,16.1 5.45,16.2 U1.A11
  Bottom 0.102: J1.64 4.5,3.02 4.81,3.33 4.81,3.61 4.62,3.8 4.58,3.8 4.02,4.36 4.02,4.77 3.25,5.54 3.25,13.12 4.73,14.61 4.73,15.9 4.93,16.1 v5.36,16.1
D46  (via drill 0.2)
  Top 0.102: v5.31,14.4 5.51,14.6 U1.A9
  Bottom 0.102: J1.62 5,2.55 5.22,2.77 5.22,3.78 4.57,4.42 4.57,4.79 3.65,5.71 3.65,12.9 5.15,14.4 v5.31,14.4
D47  (via drill 0.2)
  Top 0.102: v6.4,13.4 6.88,13.4 7.2,13.72 7.2,14.2 U1.C9
  Bottom 0.102: J1.60 5.5,4.23 5.32,4.41 5.32,6.33 5.07,6.58 5.07,8 5.2,8.13 5.2,13 5.6,13.4 v6.4,13.4
D48  (via drill 0.2)
  Top 0.102: v6.4,11.8 U1.A6
  Bottom 0.102: J1.58 6,2.51 5.84,2.66 5.84,2.94 5.97,3.07 5.97,4.7 6,4.73 6,6.23 5.74,6.49 5.74,7.14 5.94,7.34 5.94,8.16 5.8,8.3 5.8,11.2 v6.4,11.8
D49  (via drill 0.2)
  Top 0.102: v6.27,9.4 6,9.67 U1.A3
  Bottom 0.102: J1.56 6.5,2.94 6.38,3.06 6.38,4.14 6.5,4.26 6.5,7.3 6.19,7.61 6.19,9.32 v6.27,9.4
DTR  (via drill 0.2)
  Top 0.102: IC1.16 18.35,10.71 18.19,10.87 v17.78,10.87 | v19.89,11.28 19.89,11.6 C7.2
  Route2 0.102: v17.78,10.87 19.48,10.87 v19.89,11.28
EXT_RESET  (via drill 0.2)
  Top 0.102: Q1.P1 Q1.P2 18.43,4.76 v19.3,3.9
  Bottom 0.102: v19.3,3.9 19.3,3.8 19.28,3.78 19.28,2.88 19,2.6 J1.6
GND  (via drill 0.2)
  Top 0.203: 15.18,12.58 v15.2,12.58 | 6.42,14.18 v6.4,14.18 | U1.N1 15.6,7.79 15.54,7.74 v15.54,7.7 | 8.82,9.38 v8.8,9.38 | 5.6,7.8 v5.6,7.78 | J1.75 1.75,3.05 v1.6,3.2 | J1.45 v9.25,3.25 | J1.39 v10.75,3.2 | J1.33 v12.25,3.2 | J1.7 v18.75,3.2 | J1.1 20.25,2.34 20,2.59 v20,3.33
  Top 0.254: C6.2 19.09,12.95 | C3.2 17.1,17 v16.4,17 | STAT.C 20.8,19.44 v19.99,19.44 | v20.42,11.13 20.3,11.01 IC1.13 | v16.96,8.26 16.98,8.24 IC1.3 | C2.2 2.3,4.76 2.13,4.6 v2,4.6 | C8.2 20.72,14.42 | U2.2 19.65,17.13 v19.67,17.15
  Top 0.305: v9.6,15.8 U1.E11 | v12,16.6 U1.H12 | U1.L9 v13.6,15 | v11.2,13.4 U1.G7 | 15.18,12.58 U1.M6 | U1.A13 5.92,17.72 v5.5,17.72 | U1.B8 6.42,14.18 | v8.8,11.8 U1.D5 | v10.4,10.2 U1.F3 | U1.J4 v12,11 | U1.E2 8.82,9.38 | v8,10.2 U1.C3 | v19.59,13.45 19.09,12.95 | v8,19.6 C12.2 | U1.N13 16.3,17.8 v16.36,17.75 | U1.A1 5.6,7.8 | v4.8,10.4 4.8,10.8 C4.2 | C10.2 9.2,20.8 v8.8,20.4 | C9.2 4.4,6.7 v4.8,6.3 | R9.2 v0.4,6.8 | C11.2 11.2,19.6 v11.4,19.4 | 20.72,14.42 v21.34,14.42 | R7.2 v0.4,9.2 | C5.2 8.57,4.98 v8.4,4.8 | RX.C 4.57,20.8 v4.55,20.78
  Bottom 0.203: J1.36 v11.5,3.6
  pour Route2: 0,22 22,22 22,2.8 0,2.8
JTAGEN  (via drill 0.2)
  Top 0.102: U1.E5 9.2,11.54 v9.45,11.79 | R7.1 3.47,10.57 v4.27,10.57
  Route2 0.102: v9.45,11.79 9.04,12.19 5.89,12.19 v4.27,10.57
N$2  (via drill 0.2)
  Top 0.102: R1.1 18.02,12.95 18.97,13.9 20.06,13.9 20.2,14.04 20.2,15.81 20.06,15.95 19.13,15.95 18.95,16.13 18.95,17.55 18.6,17.9 v18.4,17.9 | RX.A 8.38,21.5 v11.1,21.5
  Bottom 0.102: v18.4,17.9 18.2,18.1 16.22,18.1 16.06,17.94 14.06,17.94 11.93,20.07 11.93,20.54 11.6,20.86 11.6,21.2 11.3,21.5 v11.1,21.5
N$18  (via drill 0.2)
  Top 0.102: v6.3,14.94 5.49,14.94 5.28,14.73 5.18,14.73 2.95,12.5 2.95,11.05 R3.1 | U1.C5 7.6,11.46 v7.92,11.79
  Bottom 0.102: v7.92,11.79 7.92,12.19 6.81,13.31 6.81,14.43 v6.3,14.94
N$36
  Top 0.102: R8.1 19.31,21.22 STAT.A
N$59  (via drill 0.2)
  Top 0.102: v7.92,10.97 7.92,10.93 U1.C4 | R2.1 3.96,10.06 v4.47,10.06
  Route2 0.102: v7.92,10.97 7.62,10.97 7.21,10.57 5.49,10.57 4.98,10.06 v4.47,10.06
N$67  (via drill 0.2)
  Top 0.102: R5.1 2.1,12.67 v5.08,15.65 | U1.D7 8.03,13.37 v8.03,13.39
  Bottom 0.102: v8.03,13.39 8.03,13.74 6.12,15.65 v5.08,15.65
NCONFIG  (via drill 0.2)
  Top 0.102: v6.4,16.46 6.27,16.59 5.28,16.59 1.6,12.9 1.6,11.7 R4.1 | U1.E7 9.51,13.31 v9.55,13.31
  Bottom 0.102: v6.4,16.46 v9.55,13.31
OSC
  Top 0.127: U2.3 20.75,15.45 R10.1
RESET_N  (via drill 0.2)
  Top 0.102: U1.B9 7.2,15 12.6,15 12.8,15.2 12.8,18.2 13.2,18.6 15.8,18.6 16.2,19 17.58,19 17.88,18.69 21.4,18.69 21.6,18.5 21.6,14.62 21.66,14.55 21.66,14.28 21.24,13.86 R6.1 C7.1 21.24,10.54 v21.1,10.4 | Q1.P3 17.9,5.87 18.51,5.25 v19.25,5.25
  Bottom 0.102: v19.25,5.25 20.14,5.25 21.16,6.28 21.16,10.34 v21.1,10.4
RX
  Top 0.102: IC1.2 16.86,8.89 16.64,9.11 16.64,10.35 16.39,10.6 U1.N4
RXLED  (via drill 0.2)
  Top 0.102: R1.2 18.52,11.33 v19.3,11.33 | v21.6,10.2 21.61,10.2 21.65,10.17 21.65,9.05 21.49,8.89 IC1.11
  Bottom 0.102: v19.3,11.33 19.3,11.1 19.62,10.78 21.42,10.78 21.6,10.6 v21.6,10.2
SCL  (via drill 0.2)
  Top 0.102: U1.M10 15.2,15 17.6,15 17.8,14.8 v17.76,14.76
  Bottom 0.102: v17.76,14.76 17.96,14.55 17.96,11.53 17.44,11.01 17.44,10.09 18.06,9.47 18.06,4.3 17.15,3.39 17.15,2.81 17,2.67 J1.14
SDA  (via drill 0.2)
  Top 0.102: U1.M11 15.2,15.8 18,15.8 v18.2,15.6
  Bottom 0.102: v18.2,15.6 18.46,15.34 18.46,3.67 17.5,2.7 J1.12
STAT  (via drill 0.2)
  Top 0.102: U1.K10 13.6,15.8 14.17,15.8 14.4,16.03 14.4,18 14.6,18.2 15.78,18.2 v15.85,18.27 | v18.03,19.76 18.05,19.78 R8.2
  Bottom 0.102: v15.85,18.27 17.34,19.76 v18.03,19.76
TCK  (via drill 0.2)
  Top 0.102: R9.1 2.1,7.3 1.97,7.43 0.84,7.43 v0.52,7.75 | v11.07,8.64 10.8,8.91 U1.G2
  Route2 0.102: v11.07,8.64 10.57,8.13 0.9,8.13 v0.52,7.75
  Bottom 0.102: J2.4 0.51,16.1 0.51,14.82 0.73,14.61 0.73,7.93 0.55,7.75 v0.52,7.75
TDI  (via drill 0.2)
  Top 0.102: U1.F5 v10.4,11.8
  Bottom 0.102: J2.8 0.51,20.19 0.51,20.93 1.12,21.54 9.37,21.54 11.18,19.73 11.54,19.73 11.73,19.54 11.73,19.26 11.6,19.14 11.6,13 v10.4,11.8
TDO  (via drill 0.2)
  Top 0.102: U1.F6 v10.4,12.6 | v11.02,18.22 11.2,18.4 12,18.4 12.2,18.6 v12.2,18.8
  Bottom 0.102: J2.6 0.86,18.14 0.3,18.69 0.3,21.03 1.02,21.74 9.46,21.74 11.27,19.93 11.62,19.93 11.93,19.62 11.93,19.07 v12.2,18.8 | v10.4,12.6 v10.4,12.61 10.77,12.97 10.77,15.35 11.02,15.6 v11.02,18.22
TMS  (via drill 0.2)
  Top 0.102: J2.2 2.07,14.82 3.09,14.82 3.6,15.33 v3.6,20.8 | v10.4,8.6 U1.G1
  Bottom 0.102: v3.6,20.8 4.14,21.34 9.06,21.34 9.98,20.42 9.98,9.02 v10.4,8.6
TX
  Top 0.102: IC1.15 19,10.72 18.62,11.1 18.36,11.1 18.21,11.25 15.75,11.25 U1.N5
USB_D+  (via drill 0.2)
  Top 0.102: J1.3 19.75,2.23 19.67,2.31 19.67,3.52 19.83,3.68 19.83,5.65 v19.96,5.77 | v19.23,6.1 19,6.33 IC1.6
  Bottom 0.102: v19.96,5.77 19.55,5.77 v19.23,6.1
USB_D-
  Top 0.102: J1.5 19.25,2.09 19.47,2.31 19.47,3.6 19.63,3.76 19.63,5.88 19.65,5.9 IC1.7

### Text on the board
Bottom: V10
tDocu: 4-Layer PCB / 0.8mm Thickness / 45-Degree Chamfered Edge / ENIG Finish | Alorium Technology